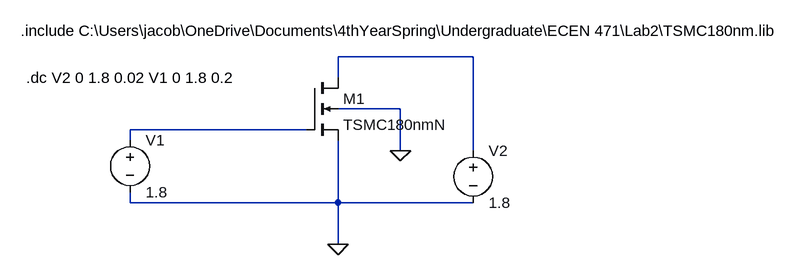
[diagram p0: schematic Draft3.asc]
Draft3.asc, the LTspice schematic file:
Version 4
SHEET 1 1004 680
WIRE 400 64 192 64
WIRE 192 96 192 64
WIRE 288 144 192 144
WIRE 144 176 -128 176
WIRE -128 192 -128 176
WIRE 288 208 288 144
WIRE 400 208 400 64
WIRE -128 288 -128 272
WIRE 192 288 192 192
WIRE 192 288 -128 288
WIRE 400 288 192 288
WIRE 192 352 192 288
FLAG 288 208 0
FLAG 192 352 0
SYMBOL nmos4 144 96 R0
SYMATTR InstName M1
SYMATTR Value TSMC180nmN
SYMATTR Value2 180nmN l=180n w=400n
SYMBOL voltage -128 176 R0
SYMATTR InstName V1
SYMATTR Value 1.8
SYMBOL voltage 400 192 R0
WINDOW 123 0 0 Left 0
WINDOW 39 0 0 Left 0
SYMATTR InstName V2
SYMATTR Value 1.8
TEXT -296 24 Left 2 !.include C:\\Users\\jacob\\OneDrive\\Documents\\4thYearSpring\\Undergraduate\\ECEN 471\\Lab2\\TSMC180nm.lib
TEXT -288 96 Left 2 !.dc V2 0 1.8 0.02 V1 0 1.8 0.2

The netlist it stands for:
* Draft3.asc
M1 N001 N002 0 0 TSMC180nmN 180nmN l=180n w=400n
V1 N002 0 1.8
V2 N001 0 1.8
.model NMOS NMOS
.model PMOS PMOS
.lib standard.mos
.include C:\Users\jacob\OneDrive\Documents\4thYearSpring\Undergraduate\ECEN 471\Lab2\TSMC180nm.lib
.dc V2 0 1.8 0.02 V1 0 1.8 0.2
.backanno
.end